# Altium project RP2040_ESP32-C3 Dev Board.PrjPcb
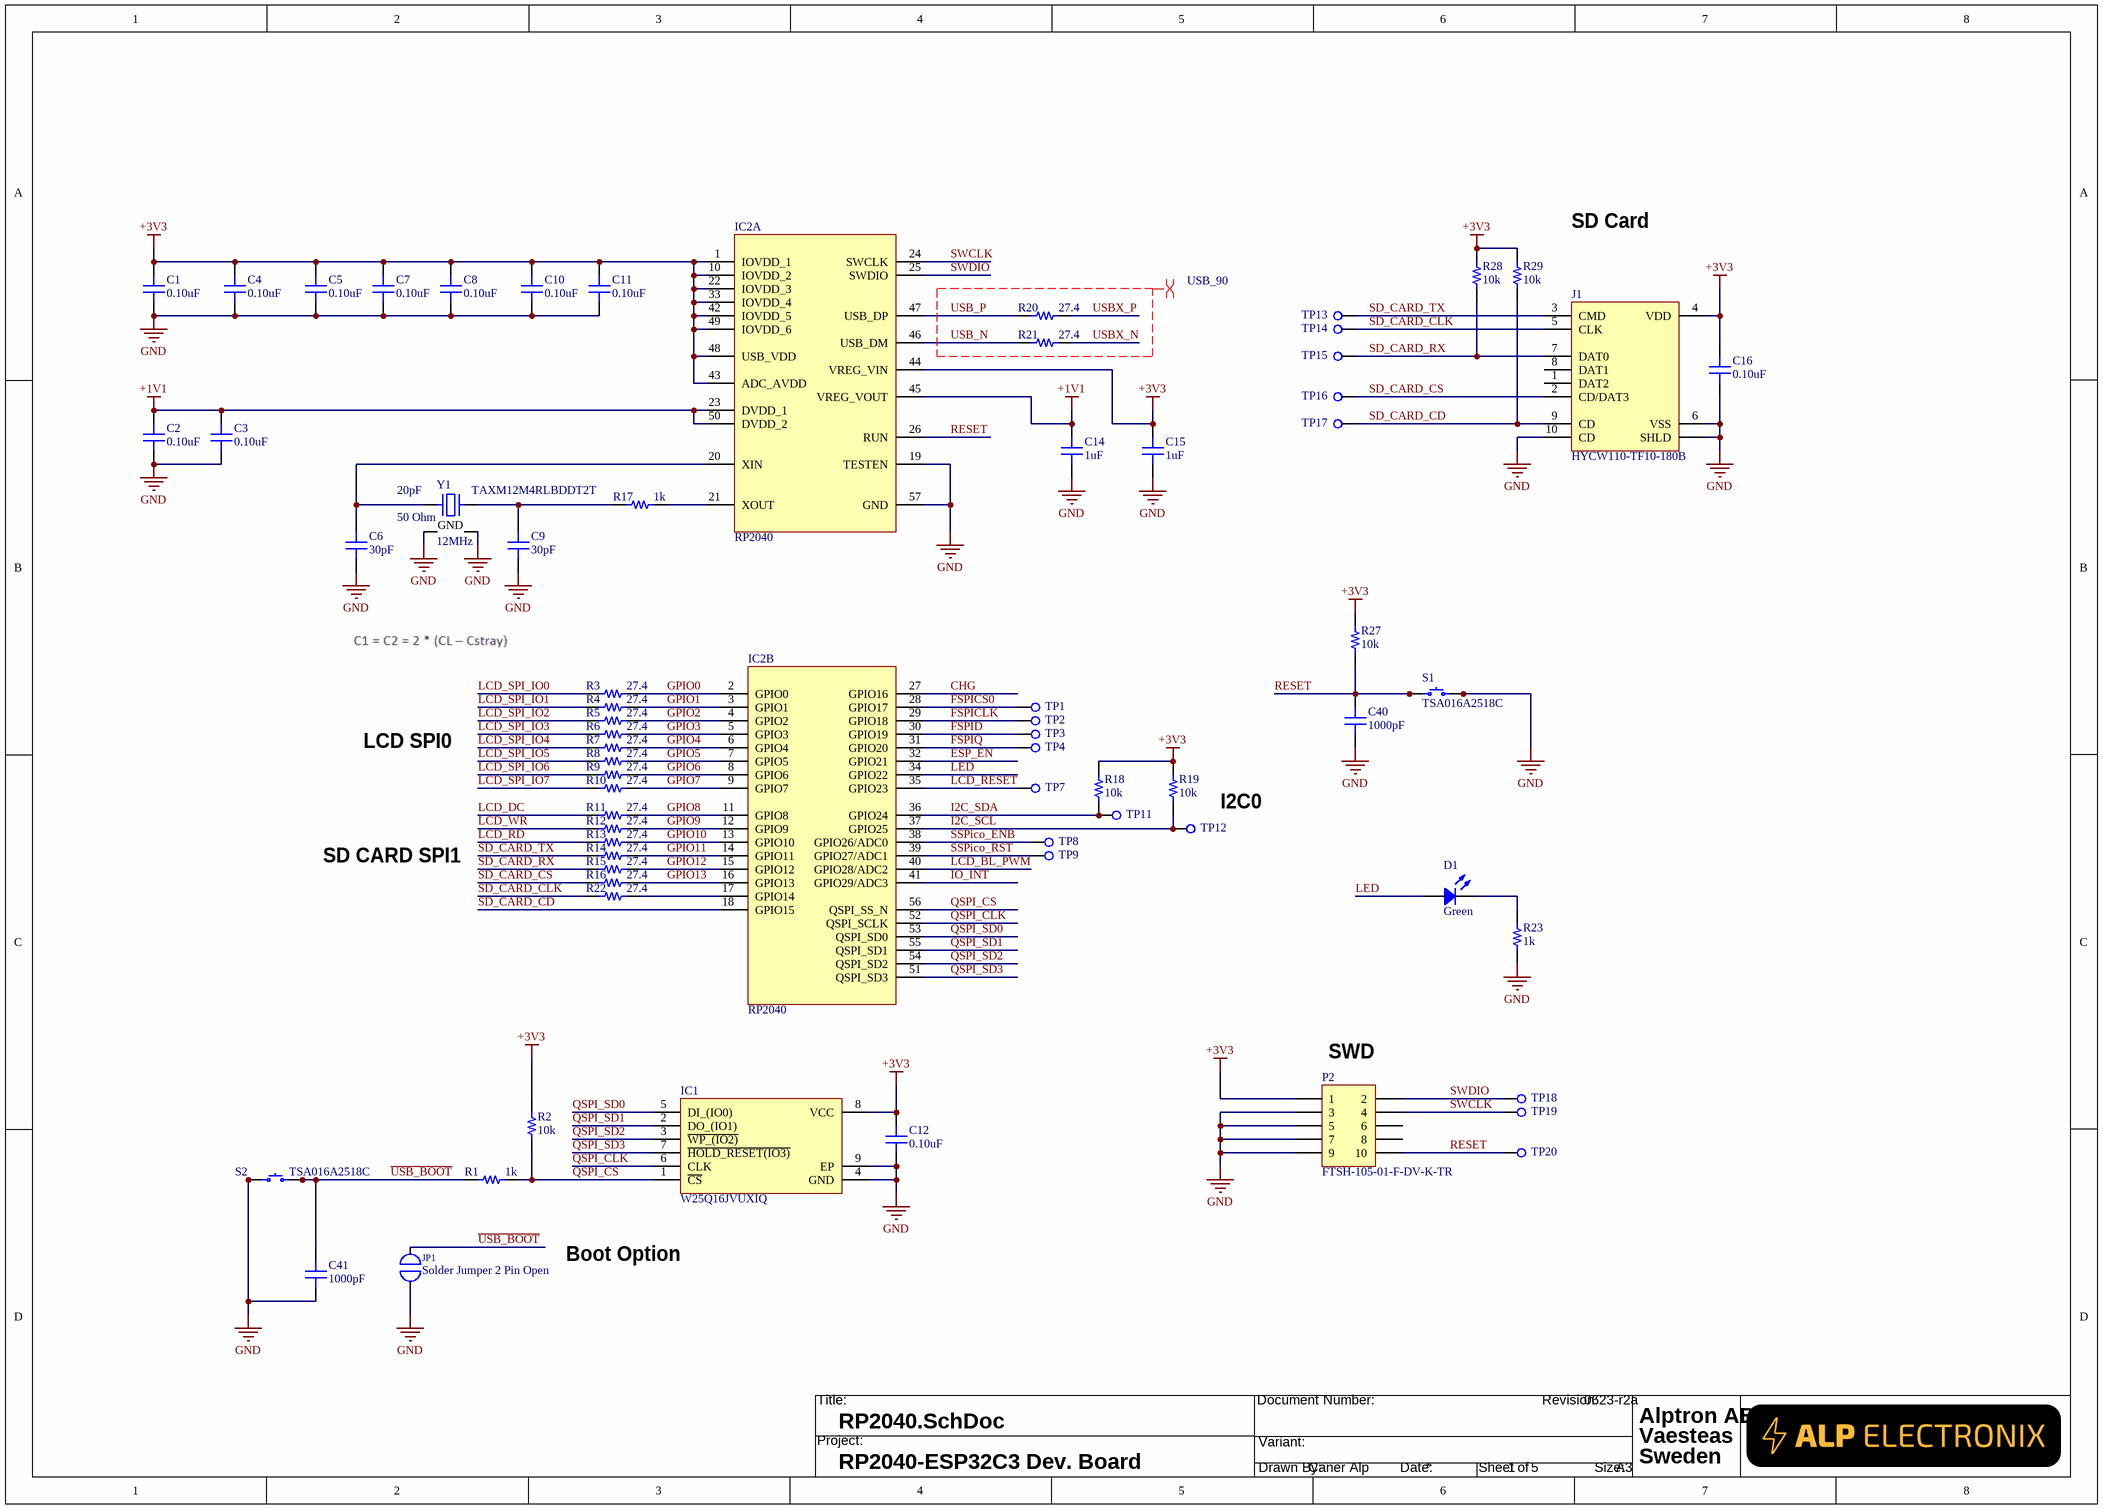
[diagram p0: RP2040.SchDoc]
revision: 0623-r2a; Project: RP2040-ESP32C3 Dev. Board; outputname: 4322-r1a
3 sheets, 104 parts. Net scope: global (net labels, ports and power ports of the same name join across sheets).
Board files: RP2040_ESP32-C3 Dev Board.PcbDoc, RP2040_ESP32-C3 Dev Panel.PcbDoc, RP2040_ESP32-C3 Dev Board P&P.PcbDoc
Sheets:
  RP2040.SchDoc
  Power.SchDoc
  Information.SchDoc

## Sheet RP2040.SchDoc
size A3; Author: Alptron AB; CompanyName: Alptron AB; DrawnBy: Caner Alp; Engineer: Caner Alp; Organization: Alptron AB; Address2: Vaesteas; Address4: Sweden; DocumentNumber: 1; SheetNumber: 1; SheetTotal: 5

### Parts
C1  0.10uF  [CAP 0402/1005]
C2  0.10uF  [CAP 0402/1005]
C3  0.10uF  [CAP 0402/1005]
C4  0.10uF  [CAP 0402/1005]
C5  0.10uF  [CAP 0402/1005]
C6  30pF  [CAP 0402/1005]
C7  0.10uF  [CAP 0402/1005]
C8  0.10uF  [CAP 0402/1005]
C9  30pF  [CAP 0402/1005]
C10  0.10uF  [CAP 0402/1005]
C11  0.10uF  [CAP 0402/1005]
C12  0.10uF  [CAP 0402/1005]
C14  1uF  [CAP 0402/1005]
C15  1uF  [CAP 0402/1005]
C16  0.10uF  [CAP 0402/1005]
C40  1000pF  [CAP 0402/1005]
C41  1000pF  [CAP 0402/1005]
D1  Green  [LED 0603/1608 GREEN]
IC1  W25Q16JVUXIQ  [SON50P300X200X60-9N]
IC2  RP2040  [QFN40P700X700X90-57N-D]  (parts A,B of 2)
J1  HYCW110-TF10-180B  [HYCW110-TF10-180B]
JP1  Solder Jumper 2 Pin Open  [SolderJumper-2_P1.3mm_Open_RoundedPad1.0x1.5mm]  (net tie, no BOM)
P2  FTSH-105-01-F-DV-K-TR  [FTSH-105-01-F-DV-K-TR]
R1  1k  [RES 0402/1005]
R2  10k  [RES 0402/1005]
R3  27.4  [RES 0402/1005]
R4  27.4  [RES 0402/1005]
R5  27.4  [RES 0402/1005]
R6  27.4  [RES 0402/1005]
R7  27.4  [RES 0402/1005]
R8  27.4  [RES 0402/1005]
R9  27.4  [RES 0402/1005]
R10  27.4  [RES 0402/1005]
R11  27.4  [RES 0402/1005]
R12  27.4  [RES 0402/1005]
R13  27.4  [RES 0402/1005]
R14  27.4  [RES 0402/1005]
R15  27.4  [RES 0402/1005]
R16  27.4  [RES 0402/1005]
R17  1k  [RES 0402/1005]
R18  10k  [RES 0402/1005]
R19  10k  [RES 0402/1005]
R20  27.4  [RES 0402/1005]
R21  27.4  [RES 0402/1005]
R22  27.4  [RES 0402/1005]
R23  1k  [RES 0402/1005]
R27  10k  [RES 0402/1005]
R28  10k  [RES 0402/1005]
R29  10k  [RES 0402/1005]
S1  TSA016A2518C  [TSA016A2518C]
S2  TSA016A2518C  [TSA016A2518C]
TP1  RCT-0C  [TestPoint 1mm]  (value not drawn)  (no BOM)
TP2  RCT-0C  [TestPoint 1mm]  (value not drawn)  (no BOM)
TP3  RCT-0C  [TestPoint 1mm]  (value not drawn)  (no BOM)
TP4  RCT-0C  [TestPoint 1mm]  (value not drawn)  (no BOM)
TP7  RCT-0C  [TestPoint 1mm]  (value not drawn)  (no BOM)
TP8  RCT-0C  [TestPoint 1mm]  (value not drawn)  (no BOM)
TP9  RCT-0C  [TestPoint 1mm]  (value not drawn)  (no BOM)
TP11  RCT-0C  [TestPoint 1mm]  (value not drawn)  (no BOM)
TP12  RCT-0C  [TestPoint 1mm]  (value not drawn)  (no BOM)
TP13  RCT-0C  [TestPoint 1mm]  (value not drawn)  (no BOM)
TP14  RCT-0C  [TestPoint 1mm]  (value not drawn)  (no BOM)
TP15  RCT-0C  [TestPoint 1mm]  (value not drawn)  (no BOM)
TP16  RCT-0C  [TestPoint 1mm]  (value not drawn)  (no BOM)
TP17  RCT-0C  [TestPoint 1mm]  (value not drawn)  (no BOM)
TP18  RCT-0C  [TestPoint 1mm]  (value not drawn)  (no BOM)
TP19  RCT-0C  [TestPoint 1mm]  (value not drawn)  (no BOM)
TP20  RCT-0C  [TestPoint 1mm]  (value not drawn)  (no BOM)
Y1  12MHz  Part Number: TAXM12M4RLBDDT2T  Load Capacitance: 20pF  ESR: 50 Ohm  [NDK NX3225SA]

### Nets
+1V1: C2.2 C3.2 C14.2 IC2.23(DVDD_1) IC2.45(VREG_VOUT) IC2.50(DVDD_2)
+3V3: C1.2 C4.2 C5.2 C7.2 C8.2 C10.2 C11.2 C12.2 C15.2 C16.2 IC1.8(VCC) IC2.1(IOVDD_1) IC2.10(IOVDD_2) IC2.22(IOVDD_3) IC2.33(IOVDD_4) IC2.42(IOVDD_5) IC2.43(ADC_AVDD) IC2.44(VREG_VIN) IC2.48(USB_VDD) IC2.49(IOVDD_6) J1.4(VDD) P2.1 R2.2 R18.2 R19.2 R27.2 R28.2 R29.2
GND: C1.1 C2.1 C3.1 C4.1 C5.1 C6.1 C7.1 C8.1 C9.1 C10.1 C11.1 C12.1 C14.1 C15.1 C16.1 C40.1 C41.1 IC1.4(GND) IC1.9(EP) IC2.19(TESTEN) IC2.57(GND) J1.6(VSS) J1.10(CD) J1.S(SHLD) JP1.1(A) P2.3 P2.5 P2.7 P2.9 R23.1 S1.3 S1.4 S2.1 S2.2 Y1.2(GND) Y1.4(GND)
~{USB_BOOT}: C41.2 JP1.2(B) R1.1 S2.3 S2.4
CHG: IC2.27(GPIO16)
ESP_EN: IC2.32(GPIO21)
FSPICLK: IC2.29(GPIO18) TP2.1(TP)
FSPICS0: IC2.28(GPIO17) TP1.1(TP)
FSPID: IC2.30(GPIO19) TP3.1(TP)
FSPIQ: IC2.31(GPIO20) TP4.1(TP)
GPIO0: IC2.2(GPIO0) R3.2
GPIO1: IC2.3(GPIO1) R4.2
GPIO2: IC2.4(GPIO2) R5.2
GPIO3: IC2.5(GPIO3) R6.2
GPIO4: IC2.6(GPIO4) R7.2
GPIO5: IC2.7(GPIO5) R8.2
GPIO6: IC2.8(GPIO6) R9.2
GPIO7: IC2.9(GPIO7) R10.2
GPIO8: IC2.11(GPIO8) R11.2
GPIO9: IC2.12(GPIO9) R12.2
GPIO10: IC2.13(GPIO10) R13.2
GPIO11: IC2.14(GPIO11) R14.2
GPIO12: IC2.15(GPIO12) R15.2
GPIO13: IC2.16(GPIO13) R16.2
I2C_SCL: IC2.37(GPIO25) R19.1 TP12.1(TP)
I2C_SDA: IC2.36(GPIO24) R18.1 TP11.1(TP)
IO_INT: IC2.41(GPIO29/ADC3)
LCD_BL_PWM: IC2.40(GPIO28/ADC2)
LCD_DC: R11.1
LCD_RD: R13.1
LCD_RESET: IC2.35(GPIO23) TP7.1(TP)
LCD_SPI_IO0: R3.1
LCD_SPI_IO1: R4.1
LCD_SPI_IO2: R5.1
LCD_SPI_IO3: R6.1
LCD_SPI_IO4: R7.1
LCD_SPI_IO5: R8.1
LCD_SPI_IO6: R9.1
LCD_SPI_IO7: R10.1
LCD_WR: R12.1
LED: D1.1 IC2.34(GPIO22)
QSPI_CLK: IC1.6(CLK) IC2.52(QSPI_SCLK)
QSPI_CS: IC1.1(~{CS}) IC2.56(QSPI_SS_N) R1.2 R2.1
QSPI_SD0: IC1.5(DI_(IO0)) IC2.53(QSPI_SD0)
QSPI_SD1: IC1.2(DO_(IO1)) IC2.55(QSPI_SD1)
QSPI_SD2: IC1.3(~{WP_(IO2)}) IC2.54(QSPI_SD2)
QSPI_SD3: IC1.7(~{HOLD}~{_RESET(IO3)}) IC2.51(QSPI_SD3)
RESET: C40.2 IC2.26(RUN) P2.10 R27.1 S1.1 S1.2 TP20.1(TP)
SD_CARD_CD: IC2.18(GPIO15) J1.9(CD) R29.1 TP17.1(TP)
SD_CARD_CLK: J1.5(CLK) R22.1 TP14.1(TP)
SD_CARD_CS: J1.2(CD/DAT3) R16.1 TP16.1(TP)
SD_CARD_RX: J1.7(DAT0) R15.1 R28.1 TP15.1(TP)
SD_CARD_TX: J1.3(CMD) R14.1 TP13.1(TP)
SSPico_ENB: IC2.38(GPIO26/ADC0) TP8.1(TP)
SSPico_RST: IC2.39(GPIO27/ADC1) TP9.1(TP)
SWCLK: IC2.24(SWCLK) P2.4 TP19.1(TP)
SWDIO: IC2.25(SWDIO) P2.2 TP18.1(TP)
USB_N: IC2.46(USB_DM) R21.1
USB_P: IC2.47(USB_DP) R20.1
USBX_N: R21.2
USBX_P: R20.2
NetC6_2: C6.2 IC2.20(XIN) Y1.1
NetC9_2: C9.2 R17.1 Y1.3
NetD1_2: D1.2 R23.2
NetIC2_17: IC2.17(GPIO14) R22.2
NetIC2_21: IC2.21(XOUT) R17.2

Not connected (* = marked no-connect by the designer): J1 1(DAT2) 8(DAT1); P2 6 8

### Layout directives
differential pair; differential pair class USB_90: USB_N, USB_P, USBX_N, USBX_P

### Notes on the sheet
- SD Card
- LCD SPI0
- I2C0
- SD CARD SPI1
- (near P2) SWD
- Boot Option
- Title:
- Project:
- Document Number:
- Variant:
- Revision:
- Drawn By:
- Date:
- Sheet
- of
- Size:
- A3

### Library data of the parts
C1-C5 C7 C8 C10-C12 C16 = LMK105BJ104KV-F: CAP CER 0.1UF 10V X5R 0402; Manufacturer: Taiyo Yuden; TemperatureRange: -55C ~ 85C; Tolerance: 10%; Value: 0.10uF; Part Number: LMK105BJ104KV-F; PartId: 12322; Supplier 1: Digi-Key; Supplier Part Number 1: 587-1227-2-ND; ComponentLink1Description: Datasheet; ComponentLink1URL: http://ds.yuden.co.jp/TYCOMPAS/ut/detail.do?productNo=LMK105BJ104KV-F&fileName=LMK105BJ104KV-F_SS&mode=specSheetDownload; ComponentLink2Description: Digi-Key Listing; ComponentLink2URL: https://www.digikey.com/product-detail/en/taiyo-yuden/LMK105BJ104KV-F/587-1227-2-ND/930579; TemperatureCoefficient: X5R; Voltage: 10V; Price: 0,0021; Device Package: 0402 (1005 Metric)
C6 C9 = GRM1555C1H300JA01D: CAP CER 30PF 50V NP0 0402; Manufacturer: Murata Electronics North America; TemperatureRange: -55C ~ 125C; TemperatureCoefficient: C0G, NP0; Tolerance: 5%; Value: 30pF; Part Number: GRM1555C1H300JA01D; PartId: 5055; Supplier 1: Digi-Key; Supplier Part Number 1: 490-5935-2-ND; ComponentLink1Description: Datasheet; ComponentLink1URL: http://www.murata.com/~/media/webrenewal/support/library/catalog/products/capacitor/mlcc/c02e.ashx; ComponentLink2Description: Digi-Key listing; ComponentLink2URL: http://digikey.com/product-detail/en/GRM1555C1H300JA01D/490-5935-2-ND/3693845; Voltage: 50V; Price: 0,0118; Type: -; Device Package: 0402 (1005 Metric)
C14 C15 = GRM155R70J105KA12D: CAP CER 1UF 6.3V X7R 0402; Manufacturer: Murata Electronics North America; TemperatureRange: -55C ~ 125C; Tolerance: 10%; Type: Derating Recommended; Value: 1uF; Part Number: GRM155R70J105KA12D; PartId: 5157; Supplier 1: Digi-Key; Supplier Part Number 1: 490-10024-2-ND; ComponentLink1Description: Datasheet; ComponentLink1URL: http://www.murata.com/~/media/webrenewal/support/library/catalog/products/capacitor/mlcc/c02e.ashx; ComponentLink2Description: Digi-Key listing; ComponentLink2URL: http://digikey.com/product-detail/en/GRM155R70J105KA12D/490-10024-2-ND/5027109; TemperatureCoefficient: X7R; Voltage: 6.3V; Price: 0,019; Device Package: 0402 (1005 Metric)
C40 C41 = C1005C0G1H102J050BA: CAP CER 1000PF 50V C0G 0402; Manufacturer: TDK Corporation; TemperatureRange: -55C ~ 125C; TemperatureCoefficient: C0G, NP0; Tolerance: 5%; Value: 1000pF; Part Number: C1005C0G1H102J050BA; PartId: 3861; Supplier 1: Digi-Key; Supplier Part Number 1: 445-6846-2-ND; ComponentLink1Description: Datasheet; ComponentLink1URL: https://product.tdk.com/info/en/catalog/datasheets/mlcc_commercial_general_en.pdf; ComponentLink2Description: Digi-Key listing; ComponentLink2URL: http://digikey.com/product-detail/en/C1005C0G1H102J050BA/445-6846-2-ND/2619187; Voltage: 50V; Price: 0,0287; Type: -; Device Package: 0402 (1005 Metric)
D1 = HSMQ-C191: LED GREEN DIFFUSED 0603 SMD; Manufacturer: Avago Technologies US Inc.; Type: Surface Mount; Millicandela: 145mcd; Voltage Forward: 3.4V; Current (Test): 20mA; Viewing Angle: 140; Value: Green; Part Number: HSMQ-C191; PartId: 7059; Supplier 1: Digi-Key; Supplier Part Number 1: 516-1807-2-ND; ComponentLink1Description: Datasheet; ComponentLink1URL: http://www.avagotech.com/docs/AV02-0977EN; ComponentLink2Description: Digi-Key Listing; ComponentLink2URL: http://www.digikey.ca/product-detail/en/HSMQ-C191/516-1807-2-ND/1012398; Price: 0,4769; Device Package: 0603 (1608 Metric); Colour: Green; Lens Transparency: Diffused
IC1 = W25Q16JVUXIQ: Integrated Circuit; Manufacturer_Name: Winbond; Datasheet Link: https://www.winbond.com/resource-files/w25q16jv%20spi%20revh%2004082019%20plus.pdf; Height: 0.6mm; Manufacturer_Part_Number: W25Q16JVUXIQ
IC2 = RP2040: Integrated Circuit; Manufacturer_Name: RASPBERRY-PI; Datasheet Link: https://datasheets.raspberrypi.org/rp2040/rp2040-datasheet.pdf; Height: 0.9mm; Manufacturer_Part_Number: RP2040
J1 = HYCW110-TF10-180B: MICRO SD PUSH/PUSH SMALL 8C; Manufacturer: SHOU HAN; Number of Positions: 9(8 + 1); Connector Type: Connector and Ejector; Part Number: HYCW110-TF10-180B; PartId: 9290; Supplier 1: LCSC; Supplier Part Number 1: C393941; ComponentLink1Description: Datasheet; ComponentLink1URL: https://datasheet.lcsc.com/szlcsc/1912111437_SHOU-HAN-TF-PUSH_C393941.pdf; ComponentLink2Description: LCSC Listing; ComponentLink2URL: https://lcsc.com/product-detail/Card-Sockets-Connectors_SHOU-HAN-TF-PUSH_C393941.html; Type: Connector and Ejector; Mounting Type: Surface Mount, Right Angle; Features: Switch; Contact Finish: Nickel
JP1 = SolderJumper_2_Open: ki_keywords: solder jumper SPST; ki_description: Solder Jumper, 2-pole, open; ki_fp_filters: SolderJumper*Open*; Supplier: ~
P2 = Header 5X2: Header, 5-Pin, Dual row; LatestRevisionDate: 17-Jul-2002; LatestRevisionNote: Re-released for DXP Platform.; Publisher: Altium Limited
R1 R17 R23 = ERJ-2GEJ102X: RES SMD 1K OHM 5% 1/10W 0402; Manufacturer: Panasonic Electronic Components; TemperatureRange: -55C ~ 155C; TemperatureCoefficient: 200ppm/C; PowerRating: 0.1W, 1/10W; Value: 1k; Part Number: ERJ-2GEJ102X; PartId: 10982; Supplier 1: Digi-Key; Supplier Part Number 1: P1.0KJTR-ND; ComponentLink1Description: Datasheet; ComponentLink1URL: http://industrial.panasonic.com/www-cgi/jvcr13pz.cgi?E+PZ+3+AOA0001+ERJ2GEJ102X+7+WW; ComponentLink2Description: Digi-Key Listing; ComponentLink2URL: https://www.digikey.com/product-detail/en/panasonic-electronic-components/ERJ-2GEJ102X/P1.0KJTR-ND/146898; Tolerance: 5%; Price: 0,0019; Device Package: 0402 (1005 Metric)
R2 R18 R19 R27-R29 = RC0402JR-0710KL: RES SMD 10K OHM 5% 1/16W 0402; Manufacturer: Yageo; TemperatureRange: -55C ~ 155C; TemperatureCoefficient: 100ppm/C; PowerRating: 0.063W, 1/16W; Value: 10k; Part Number: RC0402JR-0710KL; PartId: 14464; Supplier 1: Digi-Key; Supplier Part Number 1: 311-10KJRTR-ND; ComponentLink1Description: Datasheet; ComponentLink1URL: http://www.yageo.com/documents/recent/PYu-RC_Group_51_RoHS_L_04.pdf; ComponentLink2Description: Digi-Key Listing; ComponentLink2URL: https://www.digikey.com/product-detail/en/yageo/RC0402JR-0710KL/311-10KJRTR-ND/726418; Tolerance: 5%; Price: 0,0017; Device Package: 0402 (1005 Metric)
R3-R16 R20-R22 = ERJ-2RKF27R4X: RES SMD 27.4 OHM 1% 1/10W 0402; Manufacturer: Panasonic Electronic Components; TemperatureRange: -55C ~ 155C; TemperatureCoefficient: 100ppm/C; PowerRating: 0.1W, 1/10W; Value: 27.4; Part Number: ERJ-2RKF27R4X; PartId: 342; Supplier 1: Digi-Key; Supplier Part Number 1: P27.4LTR-ND; ComponentLink1Description: Datasheet; ComponentLink1URL: http://industrial.panasonic.com/www-cgi/jvcr13pz.cgi?E+PZ+3+AOA0002+ERJ2RKF27R4X+7+WW; ComponentLink2Description: Digikey listing; ComponentLink2URL: http://digikey.com/product-detail/en/ERJ-2RKF27R4X/P27.4LTR-ND/192262; Tolerance: 1%; Price: 0,0043; Type: Thick Film; Device Package: 0402 (1005 Metric)
S1 S2 = PTS810 SJM 250 SMTR LFS: SWITCH TACTILE SPST-NO 0.05A 16V; Manufacturer: C&K; Actuator Height off PCB, Vertical: 2.50mm; Actuator Orientation: Top Actuated; Actuator Type: Oval Button; Contact Rating @ Voltage: 0.05A @ 16VDC; Illumination: Non-Illuminated; Operating Force: 160gf; Outline: 4.20mm x 3.20mm; Switch Function: Off-Mom; Part Number: TSA016A2518C; Circuit: SPST-NO; ComponentLink1Description: Datasheet; ComponentLink1URL: https://dznh3ojzb2azq.cloudfront.net/products/Tactile/PTS810/documents/datasheet.pdf; ComponentLink2Description: DigiKey Link; ComponentLink2URL: http://digikey.com/product-detail/en/c-k/PTS810-SJM-250-SMTR-LFS/CKN10502CT-ND/4176673; LastUpdated: 2020-04-09 10:00:13; Lifecycle Status: Active; Minimum Order: 1; Mounting Type: Surface Mount; Operating Temperature: -40°C ~ 85°C; Packaging: TapeAndReel; Part Status: Active; Price: 0.16; Series: PTS810; Supplier 1: DigiKey; Supplier Part Number 1: CKN10502CT-ND; Termination Style: J Lead
TP1-TP4 TP7-TP9 TP11-TP20 = RCT-0C: 0805 PROBE PAD; Manufacturer: TE Connectivity AMP Connectors; Part Number: RCT-0C; PartId: 15704; Supplier 1: Digi-Key; Supplier Part Number 1: A106144CT-ND; ComponentLink1Description: Datasheet; ComponentLink1URL: http://www.te.com/commerce/DocumentDelivery/DDEController?Action=srchrtrv&DocNm=1773266&DocType=DS&DocLang=English; ComponentLink2Description: Digi-Key Listing; ComponentLink2URL: http://www.digikey.com/product-detail/en/te-connectivity-amp-connectors/RCT-0C/A106144CT-ND/3477801; Price: 0,14; Type: PC Test Point; Mounting Type: Surface Mount
Y1 = NX3225SA-12.000MHZ-STD-CSR-1: CRYSTAL 12.0000MHZ 8PF SMD; Manufacturer: NDK; Frequency Stability: 15ppm; Operating Mode: Fundamental; PartId: 8505; Supplier 1: LCSC; Supplier Part Number 1: 644-1047-2-ND; ComponentLink1Description: Datasheet; ComponentLink1URL: http://media.digikey.com/pdf/Data%20Sheets/NDK%20PDFs/NX3225SA.pdf; ComponentLink2Description: Digi-Key Listing; ComponentLink2URL: http://www.digikey.com/product-detail/en/NX3225SA-12.000MHZ-STD-CSR-1/644-1047-2-ND/1128829; Price: 0,3799; Type: MHz Crystal; Device Package: 4-SMD, No Lead (DFN, LCC); Frequency: 12MHz; Frequency Tolerance: 15ppm

## Sheet Power.SchDoc
size A3; Author: Alptron AB; CompanyName: Alptron AB; DrawnBy: Caner Alp; Engineer: Caner Alp; Organization: Alptron AB; Address2: Vaesteas; Address4: Sweden; DocumentNumber: 3; SheetNumber: 3; SheetTotal: 5
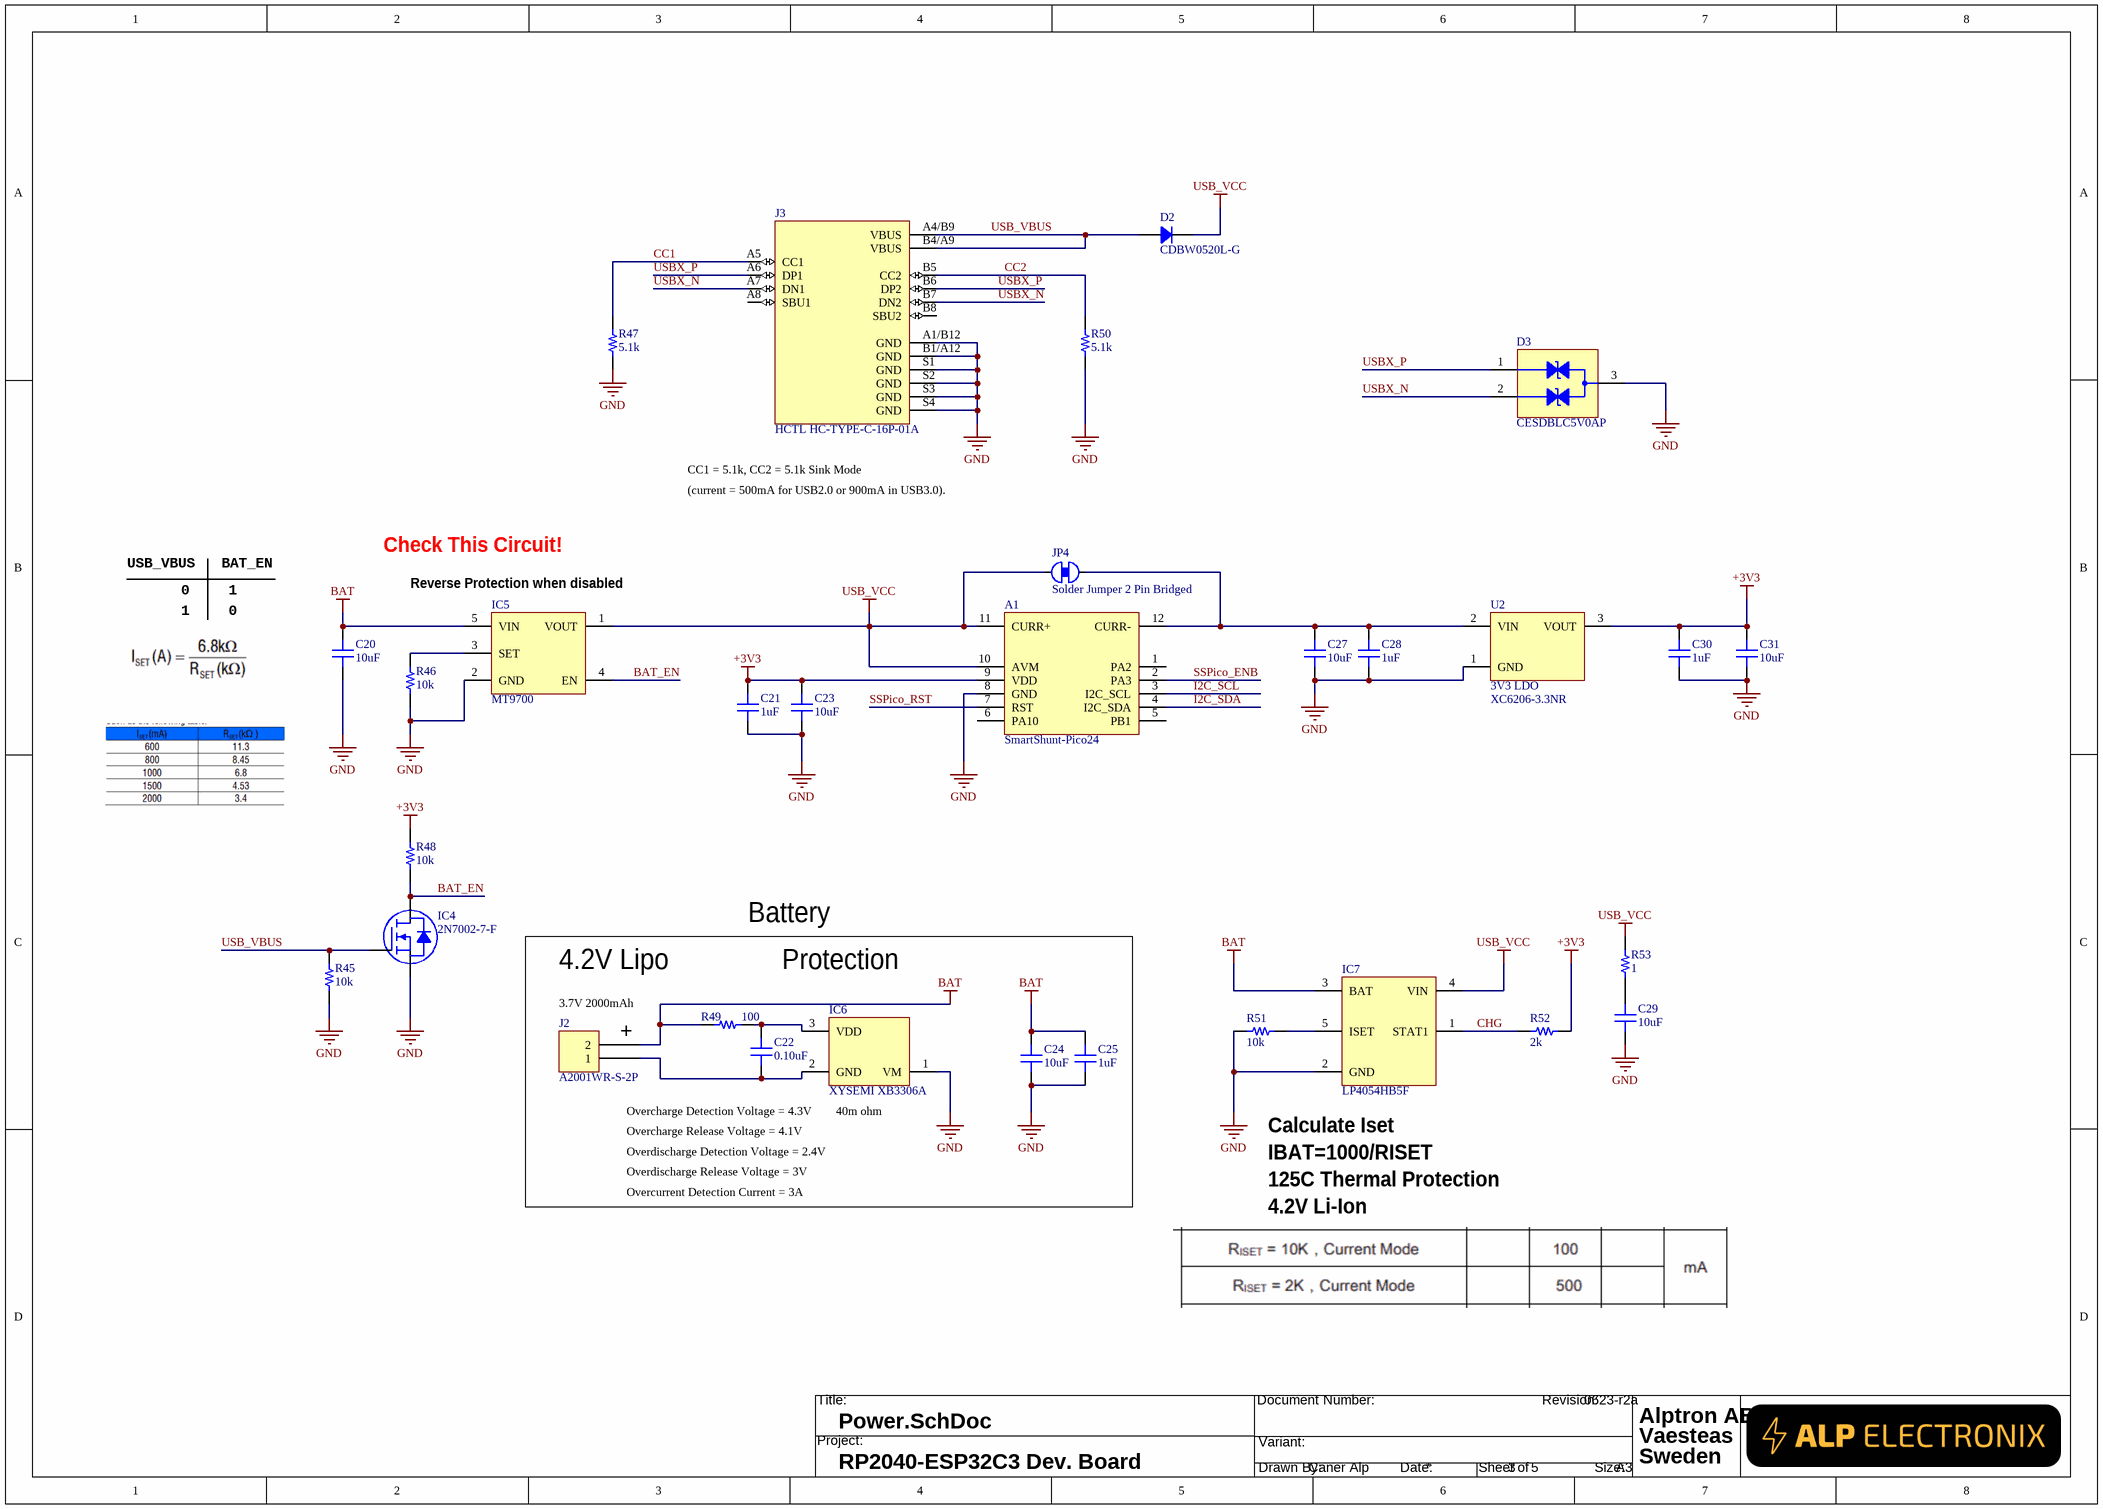
[diagram p1: Power.SchDoc]

### Parts
A1  SmartShunt-Pico24  [SmartShunt-Pico24]
C20  10uF  [CAP 0603/1608]
C21  1uF  [CAP 0402/1005]
C22  0.10uF  [CAP 0402/1005]
C23  10uF  [CAP 0603/1608]
C24  10uF  [CAP 0603/1608]
C25  1uF  [CAP 0402/1005]
C27  10uF  [CAP 0603/1608]
C28  1uF  [CAP 0402/1005]
C29  10uF  [CAP 0603/1608]
C30  1uF  [CAP 0402/1005]
C31  10uF  [CAP 0603/1608]
D2  CDBW0520L-G  [SOD-123]
D3  CESDBLC5V0AP  [ON SEMI SOT-23-3]
IC4  2N7002-7-F  [DIODES SOT-23-3]
IC5  MT9700  [DIODES SOT-23-5 W5]
IC6  XYSEMI XB3306A  [DIODES SOT-23-3]
IC7  LP4054HB5F  [DIODES SOT-23-5 W5]
J2  A2001WR-S-2P  [JST S2B-PH-SM4-TB]
J3  HCTL HC-TYPE-C-16P-01A  [HCTL HC-TYPE-C-16P-01A]
JP4  Solder Jumper 2 Pin Bridged  [SolderJumper-2_P1.3mm_Bridged_RoundedPad1.0x1.5mm]  (net tie, no BOM)
R45  10k  [RES 0402/1005]
R46  10k  [RES 0603/1608]
R47  5.1k  [RES 0402/1005]
R48  10k  [RES 0402/1005]
R49  100  [RES 0402/1005]
R50  5.1k  [RES 0402/1005]
R51  10k  [RES 0603/1608]
R52  2k  [RES 0402/1005]
R53  1  [RES 0402/1005]
U2  3V3 LDO  [DIODES SOT-23-3]

### Nets
+3V3: A1.9(VDD) C21.2 C23.2 C30.2 C31.2 R48.2 R52.2 U2.3(VOUT)
BAT: C20.2 C24.2 C25.2 IC5.5(VIN) IC7.3(BAT) J2.2 R49.1
GND: A1.8(GND) C20.1 C21.1 C23.1 C24.1 C25.1 C27.1 C28.1 C29.1 C30.1 C31.1 D3.3(I/O_2) IC4.3(S) IC5.2(GND) IC6.1(VM) IC7.2(GND) J3.A1/B12(GND) J3.B1/A12(GND) J3.S1(GND) J3.S2(GND) J3.S3(GND) J3.S4(GND) R45.1 R46.1 R47.1 R50.1 R51.1 U2.1(GND)
USB_VCC: A1.10(AVM) A1.11(CURR+) D2.2 IC5.1(VOUT) IC7.4(VIN) JP4.1(A) R53.2
BAT_EN: IC4.2(D) IC5.4(EN) R48.1
CC1: J3.A5(CC1) R47.2
CC2: J3.B5(CC2) R50.2
CHG: IC7.1(STAT1) R52.1
I2C_SCL: A1.3(I2C_SCL)
I2C_SDA: A1.4(I2C_SDA)
SSPico_ENB: A1.2(PA3)
SSPico_RST: A1.7(RST)
USB_VBUS: D2.1 IC4.1(G) J3.A4/B9(VBUS) J3.B4/A9(VBUS) R45.2
USBX_N: D3.2(GND) J3.A7(DN1) J3.B7(DN2)
USBX_P: D3.1(I/O_1) J3.A6(DP1) J3.B6(DP2)
NetA1_12: A1.12(CURR-) C27.2 C28.2 JP4.2(B) U2.2(VIN)
NetC22_1: C22.1 IC6.2(GND) J2.1
NetC22_2: C22.2 IC6.3(VDD) R49.2
NetC29_2: C29.2 R53.1
NetIC5_3: IC5.3(SET) R46.2
NetIC7_5: IC7.5(ISET) R51.2

Not connected (* = marked no-connect by the designer): A1 1(PA2) 5(PB1) 6(PA10); J3 A8(SBU1) B8(SBU2)

### Notes on the sheet
- (current = 500mA for USB2.0 or 900mA in USB3.0).
- CC1 = 5.1k, CC2 = 5.1k Sink Mode
- USB_VBUS
- BAT_EN
- Check This Circuit!
- (near IC5) Reverse Protection when disabled
- 0
- 1
- 4.2V Lipo
- Battery
- Protection
- (near J2) 3.7V 2000mAh
- (near J2) +
- Overcharge Detection Voltage = 4.3V
- (near IC6) 40m ohm
- Overdischarge Detection Voltage = 2.4V
- Overcharge Release Voltage = 4.1V
- Overdischarge Release Voltage = 3V
- (near IC7) Calculate Iset
- IBAT=1000/RISET
- 125C Thermal Protection
- Overcurrent Detection Current = 3A
- 4.2V Li-Ion
- Title:
- Project:
- Document Number:
- Variant:
- Revision:
- Drawn By:
- Date:
- Sheet
- of
- Size:
- A3

### Library data of the parts
A1 = SmartShunt-Pico24: Current Measurement Module
C20 C23 C24 C27 C29 C31 = GRM188R60J106ME47D: CAP CER 10UF 6.3V X5R 0603; Manufacturer: Murata Electronics North America; TemperatureRange: -55C ~ 85C; Tolerance: 20%; Value: 10uF; Part Number: GRM188R60J106ME47D; PartId: 12950; Supplier 1: Digi-Key; Supplier Part Number 1: 490-3896-2-ND; ComponentLink1Description: Datasheet; ComponentLink1URL: http://www.murata.com/~/media/webrenewal/support/library/catalog/products/capacitor/mlcc/c02e.pdf; ComponentLink2Description: Digi-Key Listing; ComponentLink2URL: https://www.digikey.com/product-detail/en/murata-electronics-north-america/GRM188R60J106ME47D/490-3896-2-ND/965910; TemperatureCoefficient: X5R; Voltage: 6.3V; Price: 0,031; Device Package: 0603 (1608 Metric)
C21 C25 C28 C30 = GRM155R70J105KA12D: as C14 on sheet RP2040; Value: 1uF; Part Number: GRM155R70J105KA12D; PartId: 5157; Supplier 1: Digi-Key; Supplier Part Number 1: 490-10024-2-ND; ComponentLink1Description: Datasheet; ComponentLink1URL: http://www.murata.com/~/media/webrenewal/support/library/catalog/products/capacitor/mlcc/c02e.ashx; ComponentLink2Description: Digi-Key listing; ComponentLink2URL: http://digikey.com/product-detail/en/GRM155R70J105KA12D/490-10024-2-ND/5027109; TemperatureCoefficient: X7R; Voltage: 6.3V; Price: 0,019; Device Package: 0402 (1005 Metric)
C22 = LMK105BJ104KV-F: as C1 on sheet RP2040; Value: 0.10uF; Part Number: LMK105BJ104KV-F; PartId: 12322; Supplier 1: Digi-Key; Supplier Part Number 1: 587-1227-2-ND; ComponentLink1Description: Datasheet; ComponentLink1URL: http://ds.yuden.co.jp/TYCOMPAS/ut/detail.do?productNo=LMK105BJ104KV-F&fileName=LMK105BJ104KV-F_SS&mode=specSheetDownload; ComponentLink2Description: Digi-Key Listing; ComponentLink2URL: https://www.digikey.com/product-detail/en/taiyo-yuden/LMK105BJ104KV-F/587-1227-2-ND/930579; TemperatureCoefficient: X5R; Voltage: 10V; Price: 0,0021; Device Package: 0402 (1005 Metric)
D2 = CDBW0520L-G: DIODE SCHOTTKY 20V 500MA SOD123; Manufacturer: Comchip Technology; Current - Reverse Leakage @ Vr: 250 µA @ 20 V; Speed: Fast Recovery =< 500ns, > 200mA (Io); Voltage - Forward (Vf) (Max) @ If: 385 mV @ 500 mA; Part Number: CDBW0520L-G; ComponentLink1Description: Datasheet; ComponentLink1URL: http://www.comchiptech.com/admin/files/product/CDBW0520L-HF Thru824572. CDBW0540-HF RevA.pdf; ComponentLink2Description: DigiKey Link; ComponentLink2URL: https://www.digikey.com/en/products/detail/comchip-technology/CDBW0520L-G/1979670; Current - Average Rectified (Io): 500mA; Diode Type: Schottky; LastUpdated: 2022-06-30 22:48:20; Lifecycle Status: Active; Minimum Order: 1; Mounting Type: Surface Mount; Operating Temperature - Junction: 125°C (Max); Package / Case: SOD-123; Packaging: TapeAndReel; PartId: 2251; Part Status: Active; Price: 0.07; Series: -; Supplier 1: DigiKey; Supplier Part Number 1: 641-1326-1-ND; Supplier Device Package: SOD-123; Voltage - DC Reverse (Vr) (Max): 20 V
D3 = NUP2105LT1G: TVS DIODE 24V 44V SOT23-3; Manufacturer: ON Semiconductor; Bidirectional Channels: 2; Capacitance @ Frequency: 30pF @ 1MHz; Current - Peak Pulse (10/1000µs): 8A (8/20µs); Power Line Protection: No; Power - Peak Pulse: 350W; Type: Zener; Voltage - Breakdown (Min): 26.2V; Voltage - Reverse Standoff (Typ): 24V (Min); Part Number: CESDBLC5V0AP; Applications: General Purpose; ComponentLink1Description: Datasheet; ComponentLink1URL: http://www.onsemi.com/pub/Collateral/NUP2105L-D.PDF; ComponentLink2Description: DigiKey Link; ComponentLink2URL: http://digikey.com/product-detail/en/on-semiconductor/NUP2105LT1G/NUP2105LT1GOSCT-ND/1485001; Device Package: TO-236-3, SC-59, SOT-23-3; LastUpdated: 2020-03-30 16:33:57; Lifecycle Status: Active; Minimum Order: 1; Mounting Type: Surface Mount; Operating Temperature: -55°C ~ 150°C (TJ); Package / Case: TO-236-3, SC-59, SOT-23-3; Packaging: TapeAndReel; PartId: 10506; Part Status: Active; Price: 0.09; Series: -; Supplier 1: DigiKey; Supplier Part Number 1: NUP2105LT1GOSCT-ND; Supplier Device Package: SOT-23-3 (TO-236); Voltage - Clamping (Max) @ Ipp: 44V
IC4 = 2N7002-7-F: MOSFET N-CH 60V 115MA SOT23-3; Manufacturer: Diodes Incorporated; Rds On (Max) at Id, Vgs: 7.5 Ohm @ 50mA, 5V; Vgs(th) (Max) at Id: 2.5V @ 250uA; Input Capacitance (Ciss) at Vds: 50pF @ 25V; Power - Max: 370mW; Current Continuous Drain: 115mA (Ta); Part Number: 2N7002-7-F; PartId: 7967; Supplier 1: Digi-Key; Supplier Part Number 1: 2N7002-FDITR-ND; ComponentLink1Description: Datasheet; ComponentLink1URL: http://www.diodes.com/_files/datasheets/ds11303.pdf; ComponentLink2Description: Digi-Key Listing; ComponentLink2URL: http://www.digikey.com/product-detail/en/2N7002-7-F/2N7002-FDITR-ND/717681; Price: 0,0255; Type: MOSFET N-Channel, Metal Oxide; Device Package: TO-236-3, SC-59, SOT-23-3; Gate Charge (Qg): -; Drain to Source Voltage (Vdss): 60V; Features: Standard
IC5 = MT9700: SOT-23-5 Power Distribution Switches ROHS
IC6 = XYSEMI XB3306A: IC LITHIUM BATT PROTECT SOT23-3; Function: Protection; Battery Chemistry: Li-Ion, Li-Pol; Part Number: XYSEMI XB3306A; PartId: 16446; Manufacturer: XYSEMI; Supplier 1: LCSC; Supplier Part Number 1: C154939; ComponentLink1Description: Datasheet; ComponentLink1URL: http://www.baitaishengshi.com/uploadfile/2017/1213/20171213368970.pdf; ComponentLink2Description: LCSC Listing; ComponentLink2URL: https://lcsc.com/product-detail/Battery-Protection-ICs_XB3306A_C154939.html; Device Package: SOT-23-3
IC7 = LP4054HB5F: 600mA Standalone Linear Li-Ion Battery Charger
J2 = S2B-PH-SM4-TB(LF)(SN): CONN HEADER SMD R/A 2POS 2MM; Manufacturer: JST Sales America Inc.; Contact Length - Mating: 0.130" (3.30mm); Current Rating (Amps): 2A; Material Flammability Rating: UL94 V-0; Number of Positions: 2; Number of Positions Loaded: All; Pitch - Mating: 0.079" (2.00mm); Shrouding: Shrouded - 4 Wall; Style: Board to Cable/Wire; Voltage Rating: 100V; Part Number: S2B-PH-SM4-TB(LF)(SN); ComponentLink1Description: Datasheet; ComponentLink1URL: http://www.jst-mfg.com/product/pdf/eng/ePH.pdf; ComponentLink2Description: DigiKey Link; ComponentLink2URL: http://digikey.com/product-detail/en/jst-sales-america-inc/S2B-PH-SM4-TB-LF-SN/455-1749-1-ND/926846; Connector Type: Header; Contact Finish - Mating: Tin; Contact Finish - Post: Tin; Contact Material: Copper Alloy; Contact Shape: Square; Contact Type: Male Pin; Fastening Type: Detent Lock; Features: Solder Retention; Insulation Color: Natural; Insulation Height: 0.217" (5.51mm); Insulation Material: Polyamide (PA6T), Nylon 6T; LastUpdated: 2020-01-15 03:45:11; Lifecycle Status: Active; Minimum Order: 1; Mounting Type: Surface Mount, Right Angle; Number of Rows: 1; Operating Temperature: -25°C ~ 85°C; Packaging: TapeAndReel; PartId: 115; Part Status: Active; Price: 0.27; Series: PH; Supplier 1: DigiKey; Supplier Part Number 1: 455-1749-1-ND; Termination: Solder
J3 = HIRO TYPE-C-31-M-12: CONN USB 2.0 TYPE-C R/A SMT; Manufacturer: Hiro; Number Of Positions: 12; Part Number: HCTL HC-TYPE-C-16P-01A; PartId: 9703; Supplier 1: LCSC; Supplier Part Number 1: C165948; ComponentLink1Description: Datasheet; ComponentLink1URL: https://datasheet.lcsc.com/szlcsc/1811131825_Korean-Hroparts-Elec-TYPE-C-31-M-12_C165948.pdf; ComponentLink2Description: LCSC Listing; ComponentLink2URL: https://lcsc.com/product-detail/USB-Type-C_Korean-Hroparts-Elec-TYPE-C-31-M-12_C165948.html; Type: USB - C; Series: USB 3.0
JP4 = SolderJumper_2_Bridged: ki_keywords: solder jumper SPST; ki_description: Solder Jumper, 2-pole, closed/bridged; ki_fp_filters: SolderJumper*Bridged*; Supplier: ~
R45 R48 = RC0402JR-0710KL: as R2 on sheet RP2040; Value: 10k; Part Number: RC0402JR-0710KL; PartId: 14464; Supplier 1: Digi-Key; Supplier Part Number 1: 311-10KJRTR-ND; ComponentLink1Description: Datasheet; ComponentLink1URL: http://www.yageo.com/documents/recent/PYu-RC_Group_51_RoHS_L_04.pdf; ComponentLink2Description: Digi-Key Listing; ComponentLink2URL: https://www.digikey.com/product-detail/en/yageo/RC0402JR-0710KL/311-10KJRTR-ND/726418; Tolerance: 5%; Price: 0,0017; Device Package: 0402 (1005 Metric)
R46 R51 = ERJ-3GEYJ103V: RES SMD 10K OHM 5% 1/10W 0603; Manufacturer: Panasonic Electronic Components; TemperatureRange: -55C ~ 155C; TemperatureCoefficient: 200ppm/C; PowerRating: 0.1W, 1/10W; Value: 10k; Part Number: ERJ-3GEYJ103V; PartId: 11175; Supplier 1: Digi-Key; Supplier Part Number 1: P10KGTR-ND; ComponentLink1Description: Datasheet; ComponentLink1URL: http://industrial.panasonic.com/www-cgi/jvcr13pz.cgi?E+PZ+3+AOA0001+ERJ3GEYJ103V+7+WW; ComponentLink2Description: Digi-Key Listing; ComponentLink2URL: https://www.digikey.com/product-detail/en/panasonic-electronic-components/ERJ-3GEYJ103V/P10KGTR-ND/135662; Tolerance: 5%; Price: 0,002; Device Package: 0603 (1608 Metric)
R47 R50 = RC0402JR-075K1L: RES SMD 5.1K OHM 5% 1/16W 0402; Manufacturer: Yageo; TemperatureRange: -55C ~ 155C; TemperatureCoefficient: 100ppm/C; PowerRating: 0.063W, 1/16W; Value: 5.1k; Part Number: RC0402JR-075K1L; PartId: 14528; Supplier 1: Digi-Key; Supplier Part Number 1: 311-5.1KJRTR-ND; ComponentLink1Description: Datasheet; ComponentLink1URL: http://www.yageo.com/documents/recent/PYu-RC_Group_51_RoHS_L_04.pdf; ComponentLink2Description: Digi-Key Listing; ComponentLink2URL: https://www.digikey.com/product-detail/en/yageo/RC0402JR-075K1L/311-5.1KJRTR-ND/726487; Tolerance: 5%; Price: 0,0017; Device Package: 0402 (1005 Metric)
R49 = RC0402JR-07100RL: RES SMD 100 OHM 5% 1/16W 0402; Manufacturer: Yageo; TemperatureRange: -55C ~ 155C; TemperatureCoefficient: 100ppm/C; PowerRating: 0.063W, 1/16W; Value: 100; Part Number: RC0402JR-07100RL; PartId: 14478; Supplier 1: Digi-Key; Supplier Part Number 1: 311-100JRTR-ND; ComponentLink1Description: Datasheet; ComponentLink1URL: http://www.yageo.com/documents/recent/PYu-RC_Group_51_RoHS_L_04.pdf; ComponentLink2Description: Digi-Key Listing; ComponentLink2URL: https://www.digikey.com/product-detail/en/yageo/RC0402JR-07100RL/311-100JRTR-ND/726415; Tolerance: 5%; Price: 0,0017; Device Package: 0402 (1005 Metric)
R52 = RC0402JR-072KL: RES SMD 2K OHM 5% 1/16W 0402; Manufacturer: Yageo; TemperatureRange: -55C ~ 155C; TemperatureCoefficient: 100ppm/C; PowerRating: 0.063W, 1/16W; Value: 2k; Part Number: RC0402JR-072KL; PartId: 14511; Supplier 1: Digi-Key; Supplier Part Number 1: 311-2.0KJRTR-ND; ComponentLink1Description: Datasheet; ComponentLink1URL: http://www.yageo.com/documents/recent/PYu-RC_Group_51_RoHS_L_04.pdf; ComponentLink2Description: Digi-Key Listing; ComponentLink2URL: https://www.digikey.com/product-detail/en/yageo/RC0402JR-072KL/311-2.0KJRTR-ND/726434; Tolerance: 5%; Price: 0,0017; Device Package: 0402 (1005 Metric)
R53 = RC0402JR-071RL: RES SMD 1 OHM 5% 1/16W 0402; Manufacturer: Yageo; TemperatureRange: -55C ~ 155C; TemperatureCoefficient: 200ppm/C; PowerRating: 0.063W, 1/16W; Value: 1; Part Number: RC0402JR-071RL; PartId: 14504; Supplier 1: Digi-Key; Supplier Part Number 1: 311-1.0JRTR-ND; ComponentLink1Description: Datasheet; ComponentLink1URL: http://www.yageo.com/documents/recent/PYu-RC_Group_51_RoHS_L_04.pdf; ComponentLink2Description: Digi-Key Listing; ComponentLink2URL: https://www.digikey.com/product-detail/en/yageo/RC0402JR-071RL/311-1.0JRTR-ND/726407; Tolerance: 5%; Price: 0,0017; Device Package: 0402 (1005 Metric)
U2 = XC6206-3.3NR: MPN: XC6206-3.3NR

## Sheet Information.SchDoc
size A3; Author: Alptron AB; CompanyName: Alptron AB; DrawnBy: Caner Alp; Engineer: Caner Alp; Organization: Alptron AB; Address2: Västerås; Address4: Sweden; DocumentNumber: 5; SheetNumber: 5; SheetTotal: 5
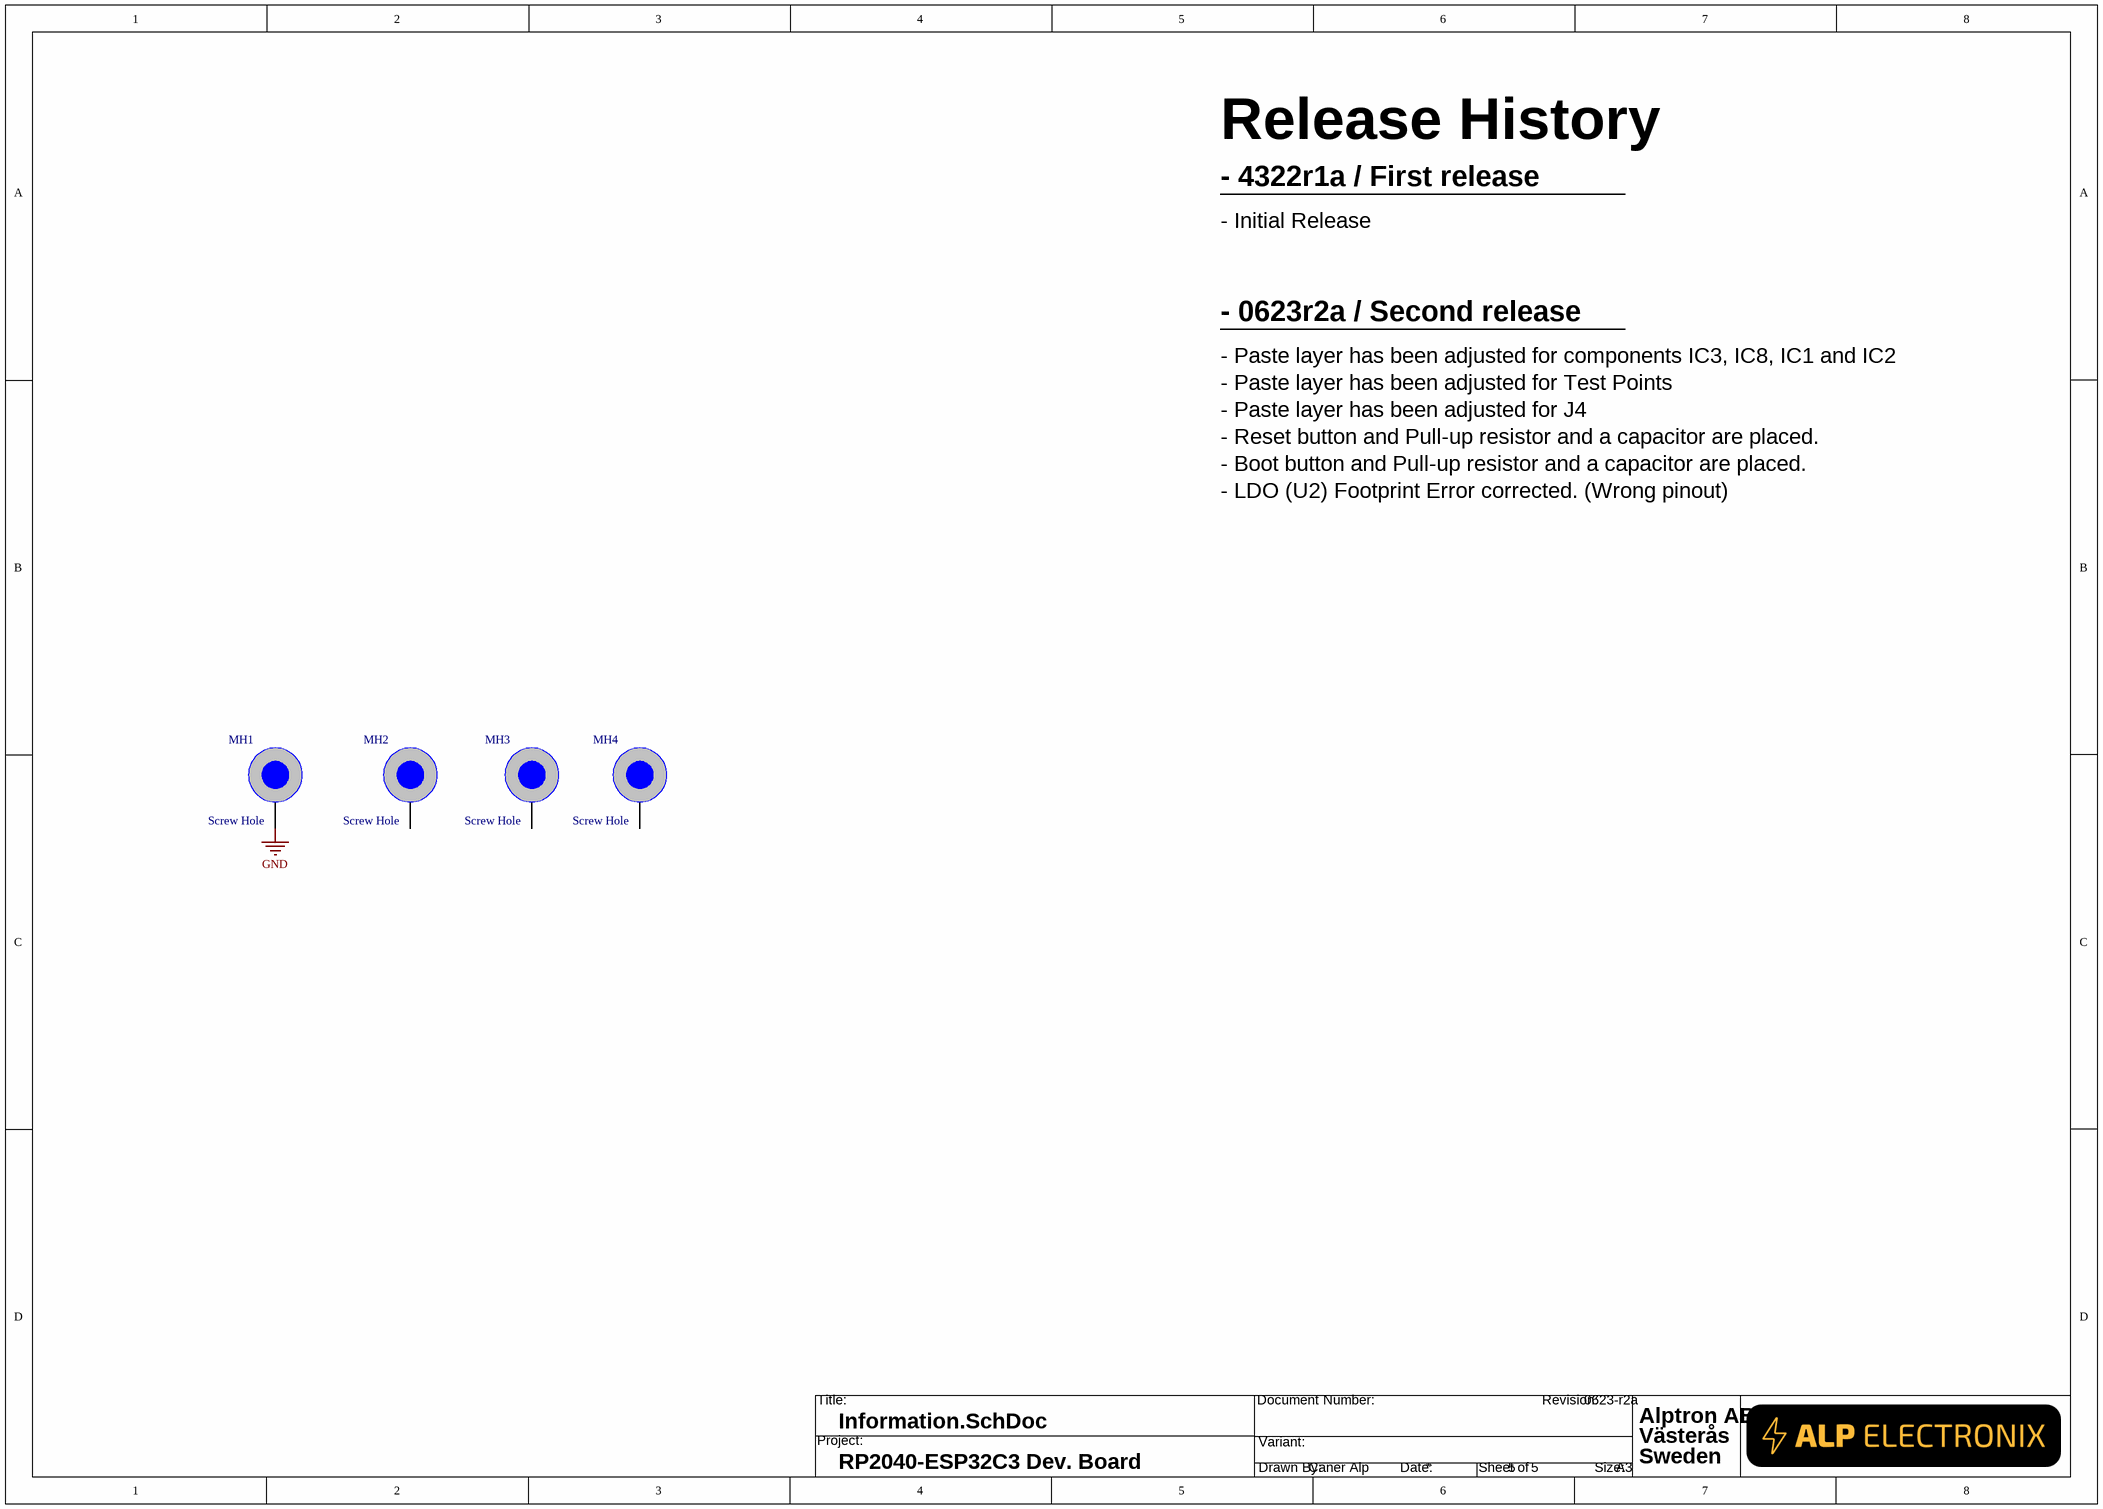
[diagram p2: Information.SchDoc]

### Parts
MH1  Screw Hole  [M3 Screw]  (no BOM)
MH2  Screw Hole  [M3 Screw]  (no BOM)
MH3  Screw Hole  [M3 Screw]  (no BOM)
MH4  Screw Hole  [M3 Screw]  (no BOM)

### Nets
GND: MH1.1

Not connected (* = marked no-connect by the designer): MH2 1; MH3 1; MH4 1

### Notes on the sheet
- Release History
- - 4322r1a / First release
- - Initial Release
- - 0623r2a / Second release
- - Paste layer has been adjusted for components IC3, IC8, IC1 and IC2
- - Paste layer has been adjusted for Test Points
- - Reset button and Pull-up resistor and a capacitor are placed.
- - Paste layer has been adjusted for J4
- - Boot button and Pull-up resistor and a capacitor are placed.
- - LDO (U2) Footprint Error corrected. (Wrong pinout)
- Title:
- Project:
- Document Number:
- Variant:
- Revision:
- Drawn By:
- Date:
- Sheet
- of
- Size:
- A3

## Nets that join several sheets
+3V3: RP2040 (28 pins), Power (8 pins)
GND: RP2040 (36 pins), Power (28 pins), Information (MH1.1)
CHG: RP2040 (IC2.27), Power (IC7.1 R52.1)
I2C_SCL: RP2040 (IC2.37 R19.1 TP12.1), Power (A1.3)
I2C_SDA: RP2040 (IC2.36 R18.1 TP11.1), Power (A1.4)
SSPico_ENB: RP2040 (IC2.38 TP8.1), Power (A1.2)
SSPico_RST: RP2040 (IC2.39 TP9.1), Power (A1.7)
USBX_N: RP2040 (R21.2), Power (D3.2 J3.A7 J3.B7)
USBX_P: RP2040 (R20.2), Power (D3.1 J3.A6 J3.B6)

## Assembly variants
Serial Production No Shunt: not fitted A1 C21 C23 P2 R24
Prototype & Development: not fitted A1 C21 C23